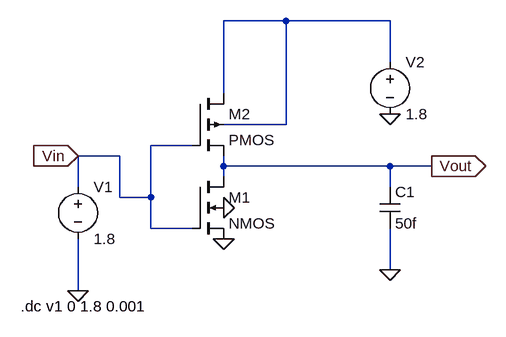
[diagram p0: schematic 180 inverter_vtc.asc]
180 inverter_vtc.asc, the LTspice schematic file:
Version 4.1
SHEET 1 880 680
WIRE 368 -64 272 -64
WIRE 528 -64 368 -64
WIRE 528 0 528 -64
WIRE 272 48 272 -64
WIRE 368 96 368 -64
WIRE 368 96 272 96
WIRE 224 128 160 128
WIRE 112 144 48 144
WIRE 272 160 272 144
WIRE 528 160 272 160
WIRE 592 160 528 160
WIRE 272 176 272 160
WIRE 48 192 48 144
WIRE 528 192 528 160
WIRE 112 208 112 144
WIRE 160 208 160 128
WIRE 160 208 112 208
WIRE 160 256 160 208
WIRE 224 256 160 256
WIRE 528 320 528 256
WIRE 48 352 48 272
FLAG 48 352 0
FLAG 528 80 0
FLAG 272 272 0
FLAG 272 224 0
FLAG 528 320 0
FLAG 48 144 Vin
IOPIN 48 144 In
FLAG 592 160 Vout
IOPIN 592 160 Out
SYMBOL nmos4 224 176 R0
SYMATTR InstName M1
SYMATTR Value2 l=90nm w=270nm
SYMBOL pmos4 224 48 R0
SYMATTR InstName M2
SYMATTR Value2 l=180nm w=810nm
SYMBOL cap 512 192 R0
SYMATTR InstName C1
SYMATTR Value 50f
SYMBOL voltage 48 176 R0
WINDOW 123 0 0 Left 0
WINDOW 39 0 0 Left 0
SYMATTR InstName V1
SYMATTR Value 1.8
SYMBOL voltage 528 -16 R0
WINDOW 123 0 0 Left 0
WINDOW 39 0 0 Left 0
SYMATTR InstName V2
SYMATTR Value 1.8
TEXT -40 376 Left 2 !.dc v1 0 1.8 0.001

The netlist it stands for:
* 180 inverter_vtc.asc
M1 Vout Vin 0 0 NMOS l=90nm w=270nm
M2 N001 Vin Vout N001 PMOS l=180nm w=810nm
C1 Vout 0 50f
V1 Vin 0 1.8
V2 N001 0 1.8
.model NMOS NMOS
.model PMOS PMOS
.lib standard.mos
.dc v1 0 1.8 0.001
.backanno
.end